# EAGLE design IoT_modules_atmega328_kinemata_v3 (EAGLE 7.2.0)
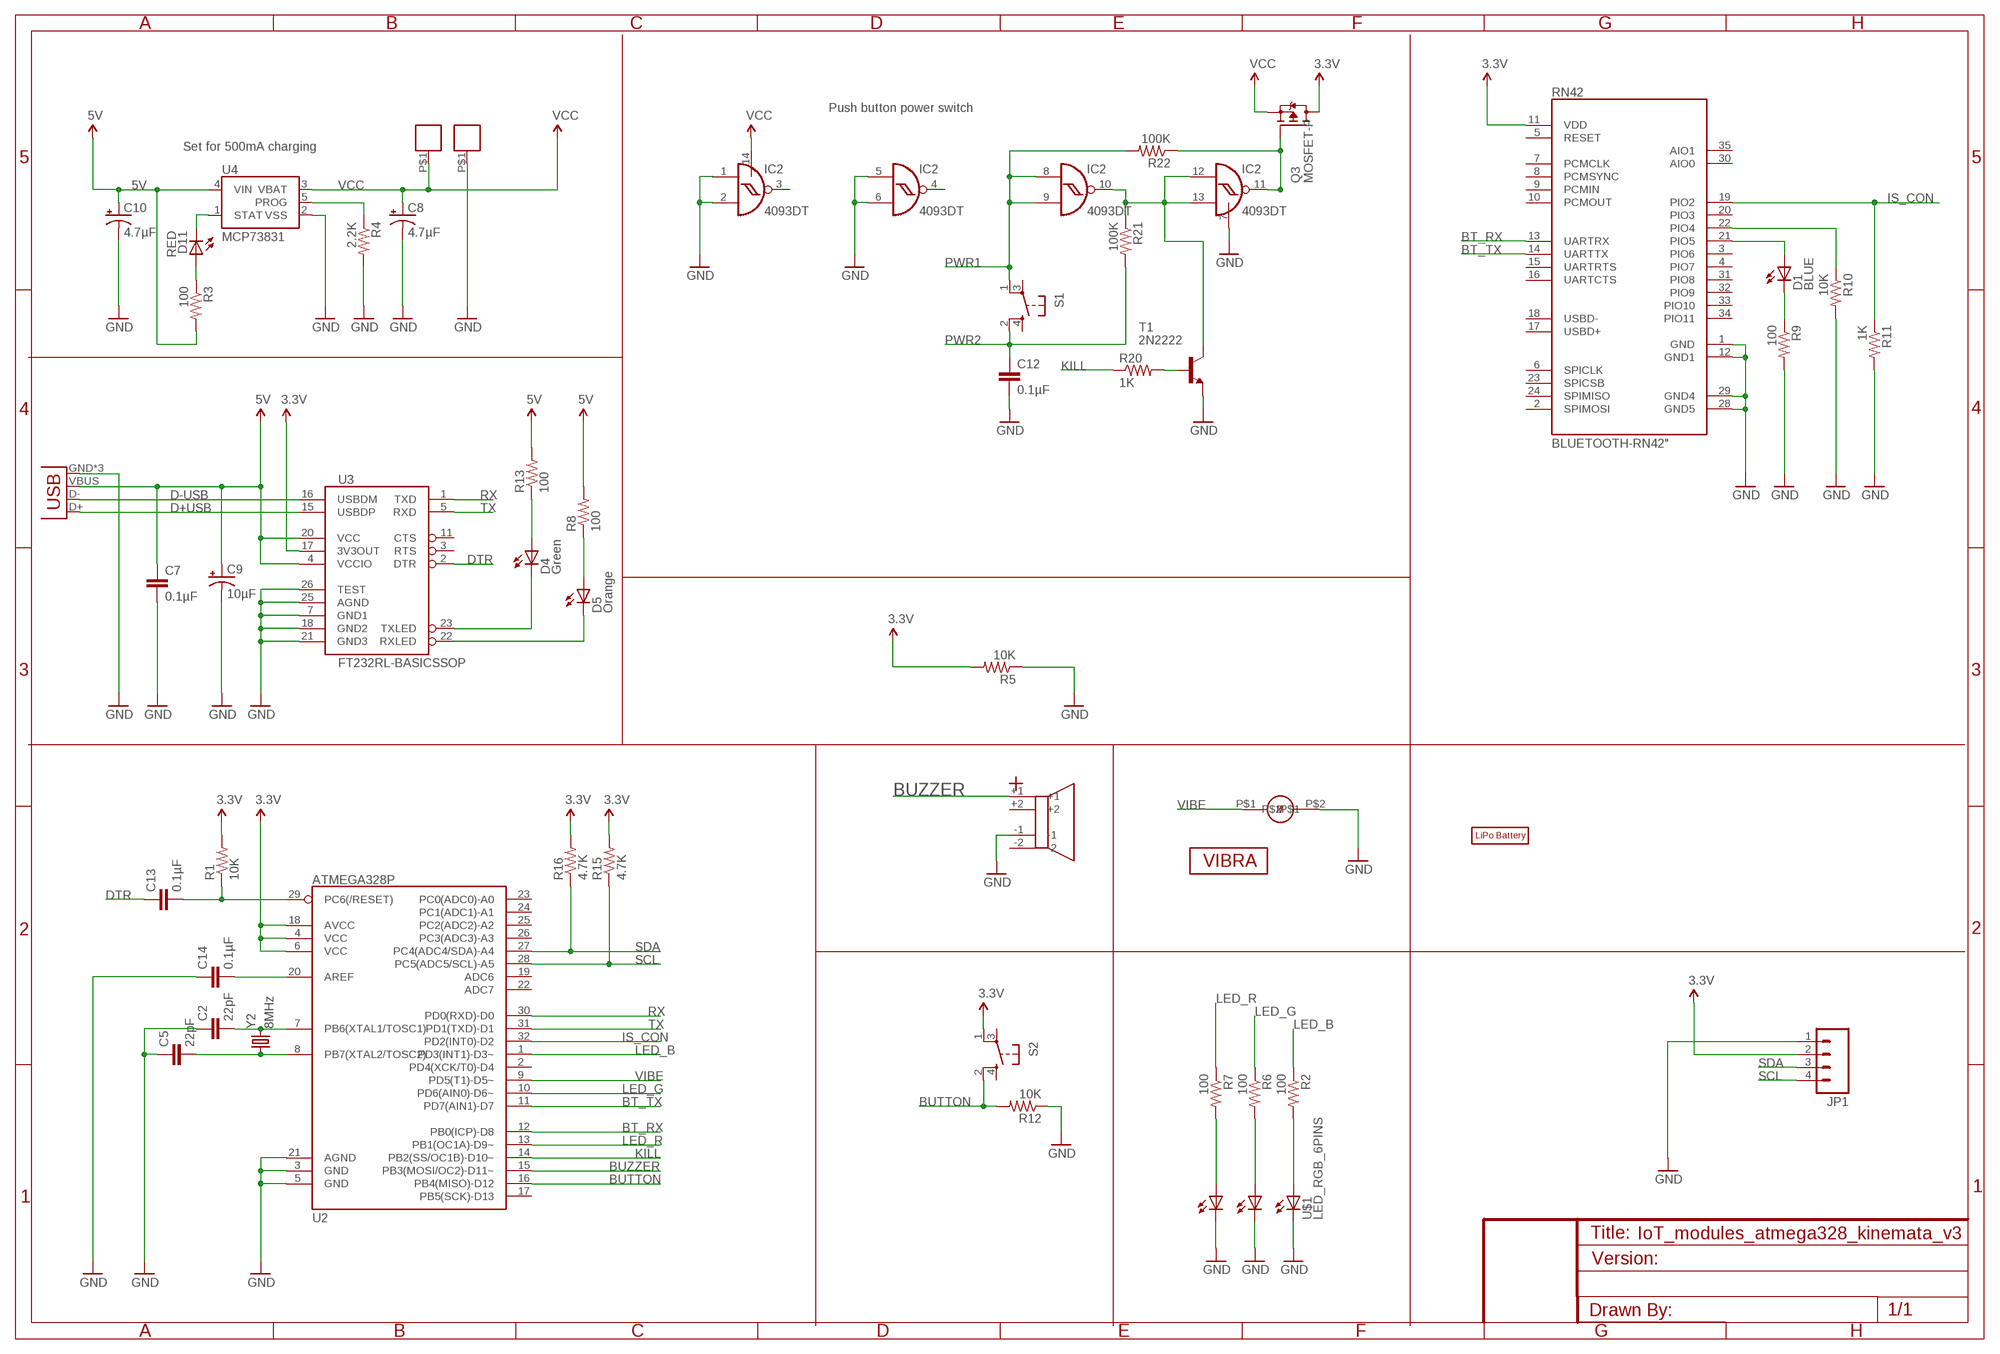
[diagram p0: schematic, sheet 1]

## Parts
BAT+2  LIPO_PAD  [LIPO_PAD]
BAT-1  LIPO_PAD  [LIPO_PAD]
C2  22pF  CAP1206  [1206]
C5  22pF  CAP1206  [1206]
C7  0.1µF  CAP1206  [1206]
C8  4.7µF  CAP_POL1206  [EIA3216]
C9  10µF  CAP_POL1206  [EIA3216]
C10  4.7µF  CAP_POL1206  [EIA3216]
C12  0.1µF  CAP1206  [1206]
C13  0.1µF  CAP1206  [1206]
C14  0.1µF  CAP1206  [1206]
D1  BLUE  LED1206  [LED-1206]
D4  Green  LED1206  [LED-1206]
D5  Orange  LED1206  [LED-1206]
D11  RED  LED1206  [LED-1206]
IC2  4093DT  [MC14093B-TSSOP14]
JP1  M04LONGPADS  [1X04_LONGPADS]
JP6  USB-MICROB  [USB-MICROB]
Q3  MOSFET-P  [SOT23]
R1  10K  RESISTOR1206  [1206]
R2  100  RESISTOR1206  [1206]
R3  100  RESISTOR1206  [1206]
R4  2.2K  RESISTOR1206  [1206]
R5  10K  RESISTOR1206  [1206]
R6  100  RESISTOR1206  [1206]
R7  100  RESISTOR1206  [1206]
R8  100  RESISTOR1206  [1206]
R9  100  RESISTOR1206  [1206]
R10  10K  RESISTOR1206  [1206]
R11  1K  RESISTOR1206  [1206]
R12  10K  RESISTOR1206  [1206]
R13  100  RESISTOR1206  [1206]
R15  4.7K  RESISTOR1206  [1206]
R16  4.7K  RESISTOR1206  [1206]
R20  1K  RESISTOR1206  [1206]
R21  100K  RESISTOR1206  [1206]
R22  100K  RESISTOR1206  [1206]
RN42  BLUETOOTH-RN42"  [RN42]
S1  TAC_SWITCH_SIDEWAY  [TACTILE_SWITCH_ANGLE_SMD]
S2  TAC_SWITCH_SIDEWAY  [TACTILE_SWITCH_ANGLE_SMD]
T1  2N2222  [TO92-EBC-OVAL]
U2  ATMEGA328P  ATMEGA328_SMT  [TQFP32-08]
U3  FT232RL-BASICSSOP  [SSOP28DB]
U4  MCP73831  [SOT23-5]
U$1  LED_RGB_6PINS  [LED_RGB_6PINS]
U$2  LIPO_BATTERY110MAH  [LIPO_BATTERY_110MAH]
U$3  BUZZER_4PINS  [FARNELL_BUZZER_MAGNETIC_SMD_3V_2215091]
U$4  VIBRATION_MOTOR_SHAPE  [VIBRATION_MOTOR_SHAPE]
U$5  VIBRATION_MOTOR  [VIBRATION_MOTOR_CABLE]
Y2  8MHz  CRYSTAL_2PINS5X3.2  [CRYSTAL_8MHZ_SMD_FARNELL_2101329]

## Nets
3.3V: JP1.2 Q3.3(D) R1.2 R5.2 R15.2 R16.2 RN42.11(VDD) S2.1(A2) U2.4(VCC) U2.6(VCC) U2.18(AVCC) U3.17(3V3OUT)
5V: C7.1 C9.A(+) C10.A(+) JP6.VBUS R3.2 R8.2 R13.2 U3.4(VCCIO) U3.20(VCC) U4.4(VIN)
BT_RX: RN42.13(UARTRX) U2.12(PB0(ICP)-D8)
BT_TX: RN42.14(UARTTX) U2.11(PD7(AIN1)-D7)
BUTTON: R12.2 S2.2(B2) U2.16(PB4(MISO)-D12)
BUZZER: U2.15(PB3(MOSI/OC2)-D11~) U$3.+1
D+USB: JP6.D+ U3.15(USBDP)
D-USB: JP6.D- U3.16(USBDM)
DTR: C13.1 U3.2(DTR)
GND: BAT-1.P$1 C2.1 C5.1 C7.2 C8.C(-) C9.C(-) C10.C(-) C12.2 C14.1 IC2.1 IC2.2 IC2.5 IC2.6 IC2.7 JP1.1 JP6.GND JP6.MT1(GND) JP6.MT2(GND) R4.2 R5.1 R9.2 R10.2 R11.2 R12.1 RN42.1(GND) RN42.12(GND1) RN42.28(GND5) RN42.29(GND4) T1.E U2.3(GND) U2.5(GND) U2.21(AGND) U3.7(GND1) U3.18(GND2) U3.21(GND3) U3.25(AGND) U3.26(TEST) U4.2(VSS) U$1.BC U$1.GC U$1.RC U$3.-1 U$5.P$2
IS_CON: R11.1 RN42.19(PIO2) U2.32(PD2(INT0)-D2)
KILL: R20.1 U2.14(PB2(SS/OC1B)-D10~)
LED_B: R2.1 U2.1(PD3(INT1)-D3~)
LED_G: R6.1 U2.10(PD6(AIN0)-D6~)
LED_R: R7.1 U2.13(PB1(OC1A)-D9~)
N$1: R7.2 U$1.BA
N$2: R2.2 U$1.GA
N$3: D11.A R3.1
N$4: R6.2 U$1.RA
N$7: D4.A R13.1
N$9: D5.A R8.1
N$12: R10.1 RN42.22(PIO4)
N$13: D1.A RN42.21(PIO5)
N$14: C5.2 U2.8(PB7(XTAL2/TOSC2)) Y2.P$1
N$16: C2.2 U2.7(PB6(XTAL1/TOSC1)) Y2.P$2
N$17: D1.C R9.1
N$18: C13.2 R1.1 U2.29(PC6(/RESET))
N$19: C14.2 U2.20(AREF)
N$23: IC2.10 IC2.12 IC2.13 R21.1 T1.C
N$24: R20.2 T1.B
N$27: IC2.11 Q3.1(G) R22.1
PROG: R4.1 U4.5(PROG)
PWR1: IC2.8 IC2.9 R22.2 S1.1(A2)
PWR2: C12.1 R21.2 S1.2(B2)
RX: U2.30(PD0(RXD)-D0) U3.1(TXD)
RXLED: D5.C U3.22(RXLED)
SCL: JP1.4 R15.1 U2.28(PC5(ADC5/SCL)-A5)
SDA: JP1.3 R16.1 U2.27(PC4(ADC4/SDA)-A4)
STAT: D11.C U4.1(STAT)
TX: U2.31(PD1(TXD)-D1) U3.5(RXD)
TXLED: D4.C U3.23(TXLED)
VCC: BAT+2.P$1 C8.A(+) IC2.14 Q3.2(S) U4.3(VBAT)
VIBE: U2.9(PD5(T1)-D5~) U$5.P$1
Unconnected: IC2.3 IC2.4 RN42.2(SPIMOSI) RN42.3(PIO6) RN42.4(PIO7) RN42.5(RESET) RN42.6(SPICLK) RN42.7(PCMCLK) RN42.8(PCMSYNC) RN42.9(PCMIN) RN42.10(PCMOUT) RN42.15(UARTRTS) RN42.16(UARTCTS) RN42.17(USBD+) RN42.18(USBD-) RN42.20(PIO3) RN42.23(SPICSB) RN42.24(SPIMISO) RN42.30(AIO0) RN42.31(PIO8) RN42.32(PIO9) RN42.33(PIO10) RN42.34(PIO11) RN42.35(AIO1) S1.3(A1) S1.4(B1) S2.3(A1) S2.4(B1) U2.2(PD4(XCK/T0)-D4) U2.17(PB5(SCK)-D13) U2.19(ADC6) U2.22(ADC7) U2.23(PC0(ADC0)-A0) U2.24(PC1(ADC1)-A1) U2.25(PC2(ADC2)-A2) U2.26(PC3(ADC3)-A3) U3.3(RTS) U3.11(CTS) U$3.+2 U$3.-2

## Notes on the sheet
- Push button power switch
- Set for 500mA charging

## Library data of the parts
BAT+2 BAT-1 = MlabPaja_v3:LIPO_PAD
C2 C5 C7 C12-C14 = SparkFun-Passives:CAP: Capacitor Standard 0603 ceramic capacitor, and 0.1" leaded capacitor.
C8-C10 = SparkFun-Passives:CAP_POL: Capacitor Polarized These are standard SMD and PTH capacitors. Normally 10uF, 47uF, and 100uF in electrolytic and tantalum varieties. Always verify the external diameter of the through hole cap, it varies with capacity, voltage, and manufacturer. The EIA devices should be standard.
D1 D4 D5 D11 = SparkFun-LED:LED: LEDs Standard schematic elements and footprints for 5mm, 3mm, 1206, and 0603 sized LEDs. 5mm - Spark Fun Electronics SKU : COM-00529 (and others)
IC2 = MlabPaja_v3:4093: Quad 2-input NAND schmitt trigger
JP1 = SparkFun-Connectors:M04: Header 4 Standard 4-pin 0.1" header. Use with straight break away headers (SKU : PRT-00116), right angle break away headers (PRT-00553), swiss pins (PRT-00743), machine pins (PRT-00117), and female headers (PRT-00115). Molex polarized connector foot print use with SKU : PRT-08231 with associated crimp pins and housings. 1MM SMD Version SKU: PRT-10208
JP6 = SparkFun-Connectors:USB: USB Connectors USB-B-PTH is fully proven SKU : PRT-00139/CONN-08278 USB-miniB is fully proven SKU : PRT-00587 USB-A-PCB is untested. USB-A-H is throughly reviewed, but untested. Spark Fun Electronics SKU : PRT-00437 USB-B-SMT is throughly reviewed, but untested. Needs silkscreen touching up. USB-A-S has not been used/tested USB-MB-H has not been used/tested USB-MICROB has been used. CONN-09505; PROD_ID: CONN-09505
Q3 = MlabPaja_v3:MOSFET-P
R1-R13 R15 R16 R20-R22 = SparkFun-Resistors:RESISTOR: Resistor Basic schematic elements and footprints for 0603, 1206, and PTH resistors.
RN42 = MlabPaja_v3:BLUETOOTH-RN42: Bluetooth SMD module
S1 S2 = MlabPaja_v3:TAC_SWITCH: Momentary Switch Button commonly used for reset or general input. Spark Fun Electronics SKU : COM-00097 SMT- SWCH-08247; PROD_ID: SWCH-08247
T1 = adafruit:2N2222: NPN TRANSISTOR Big oval pads
U2 = MlabPaja_v3:ATMEGA328_SMT: 32-Pin Atmega328 part Commonly used on Arduino compatible boards Available in QFP and QFN packages TQFP is IC-09069 QFN is non-stock; PROD_ID: IC-09069
U3 = SparkFun-DigitalIC:FT232RL-BASIC: USB UART This is the simplified version of the FT232RL unit. Only what you need, nothing you don't. Spark Fun Electronics SKU : COM-00650
U4 = SparkFun:MCP73831: Microchip's MCP73831 Miniature single cell, fully integrated Li-Ion, Li-polymer charge management controller http://ww1.microchip.com/downloads/en/DeviceDoc/21984a.pdf
U$1 = Mlab_ProEx2015:LED_RGB_6PINS
U$2 = MlabPaja_v3:LIPO_BATTERY
U$3 = MlabPaja_v2:BUZZER_4PINS
U$4 = MlabPaja_v3:VIBRATION_MOTOR_SHAPE
U$5 = MlabPaja_v3:VIBRATION_MOTOR
Y2 = MlabPaja_v2:CRYSTAL_2PINS

## Net classes
0 default: clearance 0.21 mm

## Board
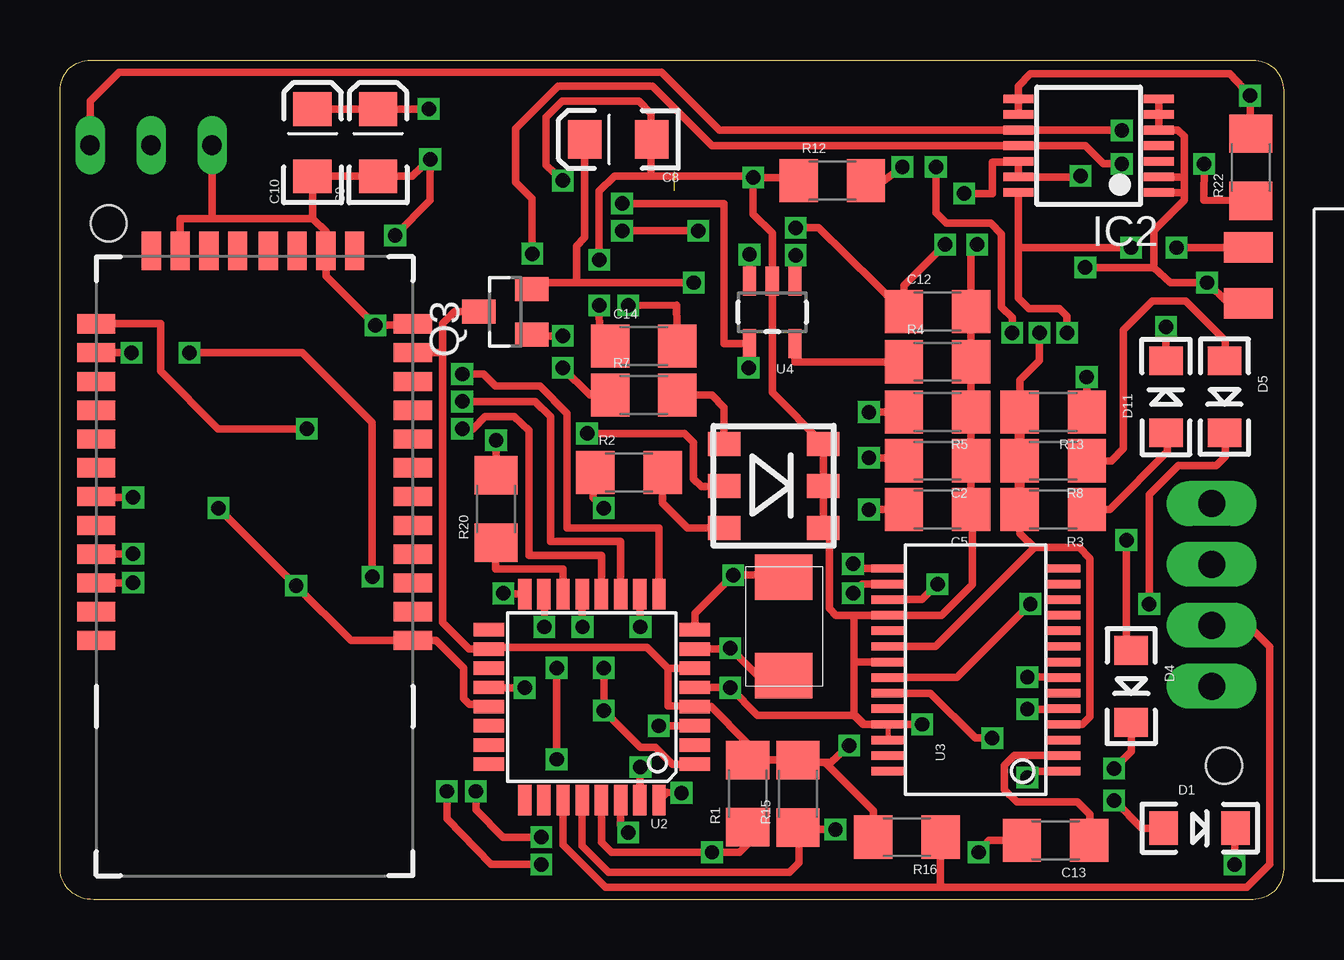
[diagram p1: board, top side]
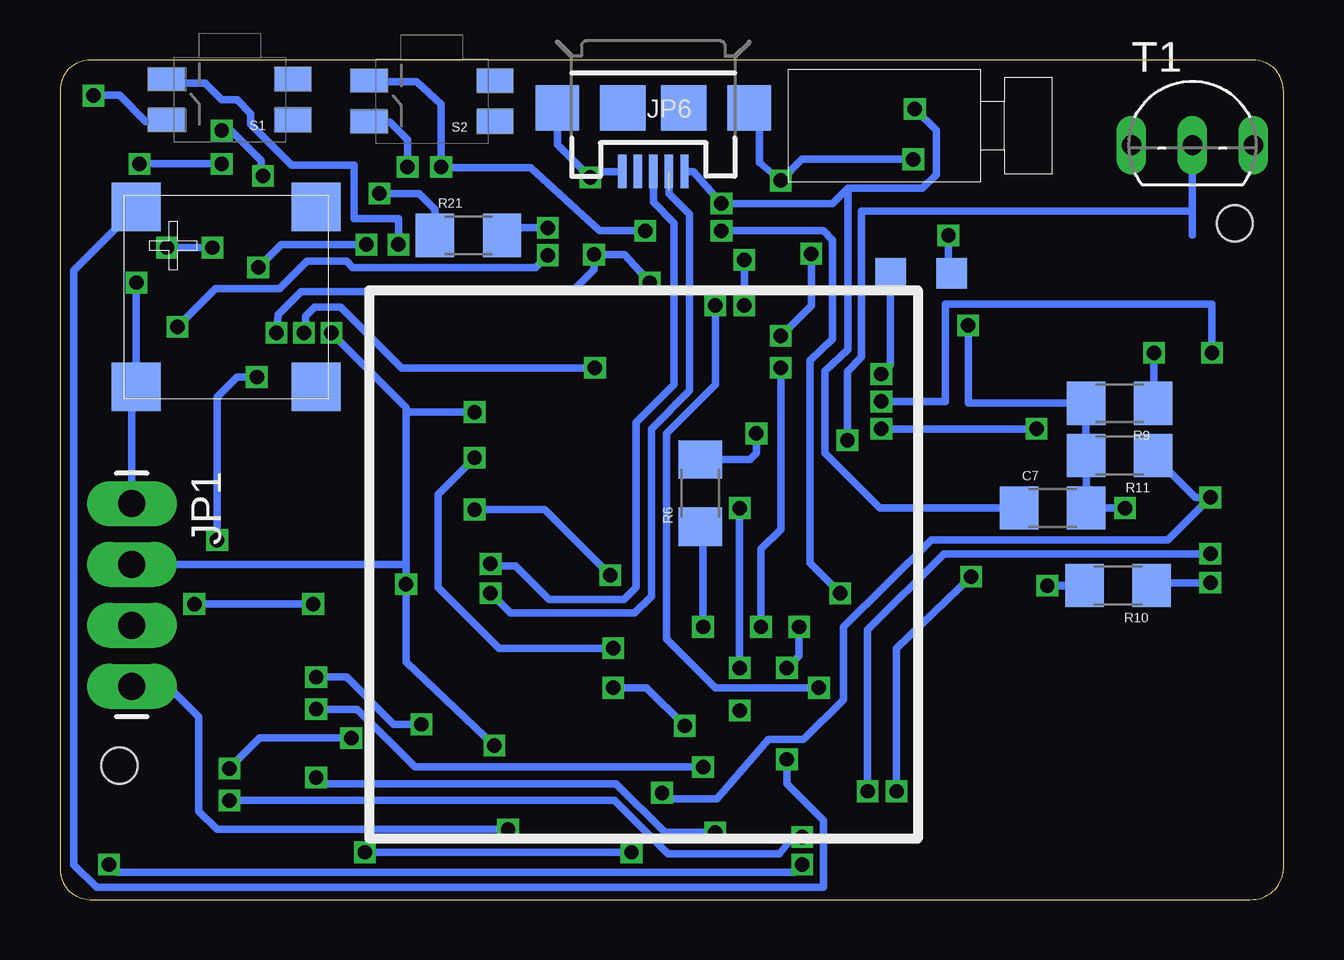
[diagram p2: board, bottom side, seen from below]

Size 51 x 35 mm. Coordinates in mm from the lower left corner, seen from the top.
Outline: 1.27,35 49.73,35 arc-90 51,33.73 51,1.27 arc-90 49.73,0 1.4,0 arc-90 0,1.26 0,33.73 arc-90 1.27,35
Copper layers (1*16): Top 0.035mm / dielectric 0.2mm / Bottom 0.035mm
Design rules "SeeedStudio_DRU_no_angle_20130527_modified": minimum track width 6mil, minimum drill 12mil, track to track 6mil, track to pad 6mil, pad to pad 6mil, via to via 6mil, smd to smd 0mil, copper to edge 10mil, drill to drill 10mil, minimum pad ring 6mil, minimum via ring 6mil, stop-mask expansion 2mil, vias tented up to drill 25mil, thermal gap 10mil
Holes 1.5 mm at 2.03,28.19 48.51,5.59

### Footprints (pad centres in the part's own frame; a part is rotated, then mirrored left to right if it is on the bottom)
LIPO_PAD = smd 2.032 x 1.27: P$1 0,0
1206 = smd 1.6 x 1.8: 1 -1.4,0; 2 1.4,0
EIA3216 = smd 1.4 x 1.6: A 1.4,0; C -1.4,0
LED-1206 = smd 1.2 x 1.4: A -1.5,0; C 1.5,0
MC14093B-TSSOP14 = smd 0.36 x 1.26: 1 -1.95,-2.925; 2 -1.3,-2.925; 3 -0.65,-2.925; 4 0,-2.925; 5 0.65,-2.925; 6 1.3,-2.925; 7 1.95,-2.925; 8 1.95,2.925; 9 1.3,2.925; 10 0.65,2.925; 11 0,2.925; 12 -0.65,2.925; 13 -1.3,2.925; 14 -1.95,2.925
1X04_LONGPADS = drill 1.118 pad 1.88 long: 1 0,0; 2 2.54,0; 3 5.08,0; 4 7.62,0
USB-MICROB = smd 0.35 x 1.4: D+ 0,2.65; D- -0.65,2.65; GND 1.3,2.65; ID 0.65,2.65; VBUS -1.3,2.65 | smd 1.8 x 1.9: MT1 -4,0; MT2 4,0 | smd 1.9 x 1.9: P$1 -1.27,0; P$2 1.27,0
SOT23 = smd 1 x 1.4: 1 -0.95,-1.1; 2 0.95,-1.1; 3 0,1.1
RN42 = smd 0.8 x 1.6: 1 -6.6,-6.6; 2 -5.4,-6.6; 3 -4.2,-6.6; 4 -3,-6.6; 5 -1.8,-6.6; 6 -0.6,-6.6; 7 0.6,-6.6; 8 1.8,-6.6; 9 3,-6.6; 10 4.2,-6.6; 11 5.4,-6.6; 12 6.6,-6.6; 13 6.6,6.6; 14 5.4,6.6; 15 4.2,6.6; 16 3,6.6; 17 1.8,6.6; 18 0.6,6.6; 19 -0.6,6.6; 20 -1.8,6.6; 21 -3,6.6; 22 -4.2,6.6; 23 -5.4,6.6; 24 -6.6,6.6 | smd 1.6 x 0.8: 28 9.65,3.1; 29 9.65,-2.973; 30 9.65,4.3; 31 9.65,1.9; 32 9.65,0.7; 33 9.65,-0.573; 34 9.65,-1.773; 35 9.65,-4.173
TACTILE_SWITCH_ANGLE_SMD = smd 1.524 x 1.016: 1 2.642,1.067; 2 2.642,-0.635; 3 -2.642,1.041; 4 -2.642,-0.635
TO92-EBC-OVAL = drill 0.813 long: B 0,-1.27; C 2.54,-1.27; E -2.54,-1.27
TQFP32-08 = smd 1.27 x 0.559: 1 -4.293,2.8; 2 -4.293,2; 3 -4.293,1.2; 4 -4.293,0.4; 5 -4.293,-0.4; 6 -4.293,-1.2; 7 -4.293,-2; 8 -4.293,-2.8; 17 4.293,-2.8; 18 4.293,-2; 19 4.293,-1.2; 20 4.293,-0.4; 21 4.293,0.4; 22 4.293,1.2; 23 4.293,2; 24 4.293,2.8 | smd 0.559 x 1.27: 9 -2.8,-4.293; 10 -2,-4.293; 11 -1.2,-4.293; 12 -0.4,-4.293; 13 0.4,-4.293; 14 1.2,-4.293; 15 2,-4.293; 16 2.8,-4.293; 25 2.8,4.293; 26 2,4.293; 27 1.2,4.293; 28 0.4,4.293; 29 -0.4,4.293; 30 -1.2,4.293; 31 -2,4.293; 32 -2.8,4.293
SSOP28DB = smd 0.348 x 1.397: 1 -4.225,-3.656; 2 -3.575,-3.656; 3 -2.925,-3.656; 4 -2.275,-3.656; 5 -1.625,-3.656; 6 -0.975,-3.656; 7 -0.325,-3.656; 8 0.325,-3.656; 9 0.975,-3.656; 10 1.625,-3.656; 11 2.275,-3.656; 12 2.925,-3.656; 13 3.575,-3.656; 14 4.225,-3.656; 15 4.225,3.656; 16 3.575,3.656; 17 2.925,3.656; 18 2.275,3.656; 19 1.625,3.656; 20 0.975,3.656; 21 0.325,3.656; 22 -0.325,3.656; 23 -0.975,3.656; 24 -1.625,3.656; 25 -2.275,3.656; 26 -2.925,3.656; 27 -3.575,3.656; 28 -4.225,3.656
SOT23-5 = smd 0.55 x 1.2: 1 -0.95,-1.3; 2 0,-1.3; 3 0.95,-1.3; 4 0.95,1.3; 5 -0.95,1.3
LED_RGB_6PINS = smd 1 x 1.35: BA -1.749,-2.07; BC -1.749,2.07; GA 1.751,-2.07; GC 1.751,2.07; RA 0.001,-2.07; RC 0.001,2.07
FARNELL_BUZZER_MAGNETIC_SMD_3V_2215091 = smd 2.032 x 2.032: +1 -3.607,3.861; +2 3.893,3.861; -1 -3.607,-3.639; -2 3.893,-3.639
VIBRATION_MOTOR_CABLE = smd 1.27 x 1.27: P$1 -1.27,0; P$2 1.27,0
CRYSTAL_8MHZ_SMD_FARNELL_2101329 = smd 1.9 x 2.4: P$1 -2.184,0.076; P$2 1.93,0.076

### Placement (x,y rotation side)
BAT+2  49.53,27.19 0 top
BAT-1  49.53,24.86 180 top
C2  36.58,18.29 180 top
C5  36.58,16.26 180 top
C7  9.63,16.32 0 bottom
C8  23.27,31.69 180 top
C9  13.26,31.55 90 top
C10  10.53,31.55 90 top
C12  36.58,24.51 0 top
C13  41.5,2.47 180 top
C14  24.34,23.07 0 top
D1  47.5,2.97 0 top
D4  44.65,8.89 270 top
D5  48.54,20.95 270 top
D11  46.1,20.95 90 top
IC2  42.88,31.43 90 top
JP1  48.01,16.51 270 bottom
JP6  26.27,33 180 bottom
Q3  18.56,24.5 90 top
R1  28.66,4.42 90 top
R2  23.72,17.8 0 top
R3  41.4,16.26 180 top
R4  36.58,22.42 0 top
R5  36.58,20.32 180 top
R6  24.31,16.94 90 bottom
R7  24.33,21.03 0 top
R8  41.4,18.29 180 top
R9  6.83,20.69 180 bottom
R10  6.9,13.09 180 bottom
R11  6.83,18.52 180 bottom
R12  32.19,29.97 0 top
R13  41.4,20.32 180 top
R15  30.77,4.4 90 top
R16  35.3,2.6 180 top
R20  18.18,16.28 90 top
R21  33.97,27.69 0 bottom
R22  49.63,30.53 90 top
RN42  8.11,17.4 90 top
S1  43.92,33.56 180 bottom
S2  35.49,33.5 180 bottom
T1  3.8,32.72 0 bottom
U2  22.17,8.44 180 top
U3  38.17,9.58 90 top
U4  29.69,24.48 180 top
U$1  29.75,17.25 270 top
U$2  57.93,16.02 90 top  (outside the outline)
U$3  44.21,25.02 0 bottom
U$4  15.94,32.38 180 bottom
U$5  15.11,26.1 0 bottom
Y2  30.1,11.26 270 top

### Tracks (layer width: path | path; a pad name or v marks a point on that pad's centre or on a via)
3.3V  (via drill 0.6)
  Top 0.203: R15.2 30.77,5.82 | 28.66,5.84 R1.2
  Top 0.305: 31.88,5.71 33.9,3.69 R16.2 | 17.4,24.44 arc-90 Q3.3 16.45,24.51 15.94,24 15.94,22.8 | 15.94,22.8 15.94,11.56 17.05,10.44 U2.18 17.94,10.51 24.47,10.51 25.34,9.64 | 26.42,8 arc90 U2.4 | R5.2 v33.72,20.32 | RN42.11 15.94,22.8 | U2.6 25.34,9.64 | 25.34,9.64 25.34,8.06 26.46,8.06 U2.4 | U2.4 27.14,8.04 28.64,6.54 28.64,5.84 R1.2 30.75,5.82 R15.2 30.86,5.71 31.88,5.71 | 31.88,5.71 32.13,5.71 v32.89,6.41 | v36.58,13.14 35.93,12.5 U3.17 | v39.69,23.62 39.69,24.26 39.24,24.7 39.24,27.75 38.8,28.19 36.96,28.19 36.51,28.64 v36.51,30.54
  Bottom 0.305: S2.1 37.34,32.41 37.23,32.41 36.51,31.69 v36.51,30.54 | v32.89,6.41 36.58,9.91 v36.58,13.14 36.58,13.97 | JP1.2 36.58,13.97 | v33.72,20.32 36.58,20.32 | 36.58,20.32 36.58,13.97 | v39.69,23.62 36.58,20.51 36.58,20.32
5V  (via drill 0.6)
  Top 0.305: U3.20 36.49,10.55 40.6,14.67 | U3.4 42.61,7.3 42.93,7.62 42.93,14.22 42.48,14.67 40.6,14.67 | C10.A C9.A 14.91,32.95 v15.37,32.96 | v23.43,29.02 27.69,29.02 27.69,23.18 U4.4 28.74,22.2 v28.7,22.16 | R13.2 40,21.65 40.83,22.48 v40.83,23.62 | R3.2 40.01,15.27 40.6,14.67
  Top 0.406: R3.2 R8.2 R13.2
  Bottom 0.305: 18.16,29.65 18.16,22.92 19.11,22.04 19.11,18.61 16.83,16.32 C7.1 | 18.16,29.65 15.05,29.65 14.48,30.23 14.48,32.07 v15.37,32.96 | JP6.VBUS 24.59,30.35 v23.43,29.02 18.8,29.02 18.16,29.65 | v28.7,22.16 36.77,22.16 39.31,24.7 40.39,24.7 40.77,24.32 40.77,23.69 v40.83,23.62
BT_RX  (via drill 0.6)
  Top 0.305: U2.12 22.57,14.35 19.56,14.35 19.56,19.56 18.92,20.13 17.72,20.13 17.21,19.62 v16.76,19.62 | RN42.13 4.19,24 4.19,22.04 6.6,19.62 v10.29,19.62
  Bottom 0.305: v16.76,19.62 v10.29,19.62
BT_TX  (via drill 0.6)
  Top 0.305: U2.11 23.37,14.92 20.45,14.92 20.45,20.13 19.81,20.77 v16.76,20.77 | v2.98,22.8 RN42.14
  Bottom 0.305: v16.76,20.77 14.1,20.77 14.1,24.83 2.98,24.83 v2.98,22.8
BUTTON  (via drill 0.6)
  Top 0.305: U2.16 18.51,12.73 v18.48,12.76 | v23.43,27.88 v26.61,27.88 | R12.2 34.35,29.97 v35.12,30.54
  Bottom 0.305: v18.48,12.76 19.75,14.03 19.75,22.48 18.8,23.37 18.8,27.5 19.18,27.88 v23.43,27.88 | S2.2 37.27,34.1 36.13,34.1 35.12,33.15 v35.12,30.54 35.08,30.5 31.39,30.5 28.51,27.88 v26.61,27.88
BUZZER  (via drill 0.6)
  Top 0.305: v20.19,11.37 20.19,12.71 U2.15 | v20.7,5.84 v20.7,9.65
  Bottom 0.203: U$3.+1 47.95,28.7
  Bottom 0.305: v20.19,11.37 20.19,10.16 v20.7,9.65 | v20.7,5.84 20.7,4.83 19.18,3.3 19.18,0.51 19.18,0.5 49.47,0.5 50.42,1.45 50.42,26.23 47.95,28.7
D+USB  (via drill 0.6)
  Top 0.305: v33.06,13.99 33.25,13.8 U3.15
  Bottom 0.305: v33.06,13.99 32.97,13.91 32,13.91 30.61,12.51 27.5,12.51 26.99,13.02 26.99,19.88 25.4,21.46 25.4,28.19 26.27,29.06 JP6.D+
D-USB  (via drill 0.6)  (1 unrouted)
  Top 0.305: v33.06,12.77 33.44,13.15 U3.16
  Bottom 0.305: v33.06,12.77 32.22,11.94 27.05,11.94 26.35,12.64 26.35,19.62 24.77,21.21 24.77,28.57 25.62,29.43 25.62,29.56
DTR
  Top 0.305: C13.1 42.92,3.54 42.4,4.06 39.88,4.06 39.37,4.57 39.37,5.59 39.78,6 U3.2
GND  (via drill 0.6)
  Top 0.203: U3.25 U3.26 | C9.C 13.26,30.48
  Top 0.305: C5.1 37.85,16.26 | IC2.2 46.83,30.12 46.86,30.16 | IC2.7 IC2.6 IC2.5 46.6,32.08 46.86,31.81 46.86,30.16 | C14.1 22.49,23.57 v22.48,24.77 | U2.5 27.48,8.84 v27.94,8.83 29.08,7.68 33.08,7.68 33.46,7.3 U3.25 | v24.96,7.24 U2.3 | U3.25 33.53,7.3 33.08,7.75 33.08,9.9 | RN42.28 5.01,28.38 6.34,28.38 | 10.54,28.38 10.54,30.13 C10.C C9.C 14.68,30.15 v15.43,30.86 15.43,29.15 v13.97,27.69 | 24.64,30.16 24.64,31.85 C8.C 24.64,31.72 24.64,32.77 24.13,33.27 20.92,33.27 20.26,32.61 20.26,30.61 v20.95,29.97 | 24.64,30.16 23.11,30.16 22.48,29.53 v22.48,26.67 | RN42.12 14.71,23.94 v13.14,23.94 11.09,26 RN42.29 11.09,27.84 10.54,28.38 | U2.21 17.79,8.13 17.08,8.13 16.83,8.38 16.83,9.65 15.68,10.8 RN42.1 12.13,10.79 v9.84,13.08 v6.6,16.32 | 6.34,28.38 10.54,28.38 | 33.08,11.85 U3.18 36.74,11.85 38.04,13.14 38.04,16.2 C5.1 | 33.08,11.85 32.34,11.85 32.07,12.13 32.07,15.12 U$1.GC U$1.RC U$1.BC 29.69,21.13 U4.2 29.69,27.78 28.89,28.57 v28.89,30.1 | U3.21 33.08,9.9 | 33.08,9.9 33.08,11.85 | C5.1 C2.1 R5.1 R4.2 C12.2 37.98,27.05 v38.23,27.3 | 24.64,30.16 28.83,30.16 v28.89,30.1 | 46.86,30.16 46.86,29.46 | 46.86,29.46 46.86,29.15 45.59,27.88 45.59,26.35 | 45.59,26.35 v42.74,26.35 | 45.59,26.35 46.29,25.72 v47.82,25.72 48.67,24.89 BAT-1.P$1 | IC2.1 46.85,29.48 46.86,29.46 | U3.7 41.81,9.27 v40.32,9.27 | v35.94,7.3 U3.25 | U3.25 | T1.E 6.34,28.38 | v28.89,30.1 30.67,30.1 R12.1
  Bottom 0.203: R11.2 8.23,18.67
  Bottom 0.305: JP1.1 48.01,20.93 arc45 U$3.-1 v47.82,25.72 | R11.2 arc90 R11.2 C7.2 v6.6,16.32 | 8.23,18.67 R9.2 13.14,20.69 v13.14,23.94 | v38.23,27.3 41.78,27.3 v42.74,26.35 | v22.48,24.77 v22.48,26.67 | v27.94,8.83 26.54,8.83 v24.96,7.24 | v40.32,9.27 39.05,9.27 37.08,7.3 v35.94,7.3 | JP6.MT1 21.84,33.43 21.84,30.73 v20.95,29.97 20.07,30.86 v15.43,30.86 | JP6.GND 28.64,30.35 v28.89,30.1 30.27,31.48 JP6.MT2 | U$5.P$2 13.97,26.24 v13.97,27.69 | v9.84,13.08 R10.2 9.83,13.09 v9.84,13.08
  cutout Bottom: -1.27,36.83 51.8,36.83 51.8,-1.27 15.24,-1.27 15.24,10.16 -1.27,10.16
  cutout Top: -1.27,36.83 -1.27,10.16 15.24,10.16 15.24,-1.27 51.8,-1.27 51.8,36.83
IS_CON  (via drill 0.6)
  Top 0.305: RN42.19 arc90 1.55,16.76 v3.05,16.76 | U2.32 25.3,4.47 v25.91,4.45
  Bottom 0.203: 5.46,18.52 R11.1
  Bottom 0.305: v25.91,4.45 25.65,4.19 23.62,4.19 21.46,6.67 20,6.67 18.35,8.32 18.35,11.37 14.67,14.99 4.83,14.99 v3.05,16.76 3.68,16.76 R11.1
KILL
  Top 0.305: U2.14 20.97,13.78 18.16,13.78 18.16,14.44 R20.1
LED_B  (via drill 0.6)
  Top 0.305: v22.67,9.65 v22.67,7.87 24.19,6.35 24.83,6.35 25.54,5.64 U2.1 | R2.1 22.23,17.71 22.23,16.76 v22.67,16.32
  Bottom 0.305: v22.67,9.65 v22.67,16.32
LED_G  (via drill 0.6)
  Top 0.305: U2.10 24.17,11.52 v24.19,11.37
  Bottom 0.305: v24.19,11.37 24.19,15.53 R6.1
LED_R  (via drill 0.6)
  Top 0.305: U2.13 21.77,11.49 v21.78,11.37 | R7.1 22.09,21.03 v20.95,22.16
  Bottom 0.305: v21.78,11.37 21.78,14.61 20.95,15.43 v20.95,22.16
N$1
  Top 0.305: R7.2 27.17,21.03 27.69,20.51 U$1.BA
N$2
  Top 0.305: R2.2 25.12,16.54 26.16,15.49 U$1.GA
N$3
  Top 0.305: 45.97,19.41 D11.A 46.16,19.39 46.16,18.67 43.75,16.26 R3.1
N$4  (via drill 0.6)
  Top 0.305: v21.97,19.43 26.04,19.43 26.42,19.05 26.42,17.53 26.73,17.21 27.64,17.21 U$1.RA
  Bottom 0.305: R6.2 22.23,18.34 21.97,18.61 v21.97,19.43
N$7  (via drill 0.6)
  Top 0.305: R13.1 v42.8,21.78 | v44.45,14.99 44.45,10.59 D4.A
  Bottom 0.305: v42.8,21.78 43.62,21.78 44.45,20.95 v44.45,14.99
N$9
  Top 0.305: R8.1 43.81,18.29 44.32,18.8 44.32,23.75 45.53,24.96 46.93,24.96 48.58,23.3 48.58,22.49 D5.A
N$12  (via drill 0.6)
  Top 0.305: RN42.22 3.04,13.2 v3.05,13.21
  Bottom 0.305: v3.05,13.21 5.38,13.21 R10.1
N$13  (via drill 0.6)
  Top 0.305: D1.A 45.1,2.97 v43.94,4.13 | v20.07,2.6 18.48,2.6 17.34,3.75 v17.34,4.51 | v3.05,14.41 1.53,14.41 RN42.21
  Bottom 0.305: v43.94,4.13 27.88,4.13 25.65,1.91 21.02,1.91 20.45,2.6 v20.07,2.6 | v17.34,4.51 17.34,11.24 14.16,14.41 v3.05,14.41
N$14  (via drill 0.6)
  Top 0.305: Y2.P$1 30.09,13.53 v28.07,13.53 26.46,11.92 U2.8 | C5.2 v33.72,16.26
  Bottom 0.305: v33.72,16.26 30.8,16.26 v28.07,13.53
N$16  (via drill 0.6)
  Top 0.305: U2.7 27.9,10.44 v27.94,10.48 29.09,9.32 Y2.P$2 | v33.72,18.41 35.11,18.41 C2.2
  Bottom 0.305: v27.94,10.48 32.7,10.48 35.24,13.02 35.24,16.89 v33.72,18.41
N$17  (via drill 0.6)
  Top 0.305: v20.07,1.46 17.97,1.46 16.13,3.37 v16.13,4.51 | v13.02,13.46 13.02,19.88 10.1,22.8 v5.4,22.8 | v48.96,1.46 48.96,2.93 D1.C
  Bottom 0.305: v5.4,22.8 5.4,20.73 R9.1 | v13.02,13.46 16.13,10.48 v16.13,4.51 | v20.07,1.46 20.38,1.14 48.64,1.14 v48.96,1.46
N$18  (via drill 0.6)
  Top 0.305: 28.57,2.92 R1.1 28.7,2.98 28.7,2.35 28.32,1.97 v27.18,1.97 22.99,1.97 22.57,2.39 U2.29 | C13.2 38.73,2.47 v38.29,1.97
  Bottom 0.305: v38.29,1.97 v27.18,1.97
N$19  (via drill 0.6)
  Top 0.305: C14.2 25.7,24.78 v23.69,24.77 | v19.37,8.83 17.89,8.83 U2.20
  Bottom 0.305: v23.69,24.77 23.69,21.46 25.72,19.43 25.72,10.86 23.69,8.83 v19.37,8.83
N$23  (via drill 0.6)
  Top 0.305: IC2.12 IC2.13 42.51,30.12 v42.55,30.16 | IC2.12 39.93,30.67 | IC2.12 39.91,30.73 38.86,30.73 38.86,29.43 v37.69,29.43 | v44.26,32.07 43.81,32.08 IC2.10 27.49,32.08 25.08,34.48 2.48,34.48 1.27,33.27 T1.C
  Bottom 0.305: R21.1 35.37,28.77 36.04,29.43 v37.69,29.43 | v44.26,32.07 43.88,32.07 42.61,30.8 42.61,30.16 v42.55,30.16
N$24  (via drill 0.6)
  Top 0.305: v18.18,19.14 R20.2
  Bottom 0.305: v18.18,19.14 18.18,22.02 17.59,22.61 17.59,28.7 3.81,28.7 3.8,27.7 T1.B
N$27  (via drill 0.6)
  Top 0.305: v20.95,23.5 19.72,23.5 Q3.1 | v47.69,30.67 47.68,29.15 R22.1 | v19.68,26.92 19.68,29.21 18.99,29.91 18.99,32.13 20.77,33.91 24.7,33.91 27.19,31.43 IC2.11 42.74,31.43 43.5,30.67 v44.26,30.67
  Bottom 0.305: v19.68,26.92 19.68,24.77 v20.95,23.5 | v44.26,30.67 v47.69,30.67
PROG
  Top 0.305: U4.5 30.64,22.42 R4.1
PWR1  (via drill 0.6)
  Top 0.305: IC2.9 IC2.8 39.94,33.91 40.45,34.42 48.77,34.42 v49.61,33.51 R22.2
  Bottom 0.305: S1.1 46.66,32.43 47.42,32.43 48.51,33.53 49.59,33.53 v49.61,33.51
PWR2  (via drill 0.6)
  Top 0.305: v30.67,28 31.62,28 C12.1 35.18,25.59 v36.89,27.3
  Bottom 0.305: R21.2 32.26,28 v30.67,28 | v36.89,27.3 36.89,28.38 38.73,28.38 38.73,30.61 41.34,30.61 43.05,32.32 43.05,32.77 43.62,33.34 44.26,33.34 44.96,34.04 46.14,34.04 S1.2
RX  (via drill 0.6)
  Top 0.305: U2.30 23.37,3.11 v23.69,2.79 | U3.1 40.34,5.35 v40.32,5.08
  Bottom 0.305: v23.69,2.79 25.78,2.79 27.81,4.83 39.81,4.83 v40.32,5.08
RXLED  (via drill 0.6)
  Top 0.305: U3.22 37.38,9.25 v40.45,12.32 | v45.4,12.32 45.4,16.89 46.61,18.1 48.2,18.1 48.58,18.48 48.58,19.42 D5.C
  Bottom 0.305: v40.45,12.32 v45.4,12.32
SCL  (via drill 0.6)
  Top 0.305: R15.1 30.85,2.92 v32.32,2.92 | 30.73,2.97 R15.1 | U2.28 21.77,2.23 22.86,1.14 30.42,1.14 30.8,1.52 30.8,2.97 R15.1
  Bottom 0.305: v32.32,2.92 44.45,2.92 45.21,3.68 45.21,7.62 46.48,8.89 JP1.4
SDA
  Top 0.305: JP1.3 49.53,11.43 50.42,10.54 50.42,1.46 49.47,0.51 36.7,0.51 | 36.45,2.03 R16.1 36.7,2.03 36.7,0.51 | 20.95,4.13 U2.27 20.97,2.27 22.73,0.51 36.7,0.51
STAT  (via drill 0.6)
  Top 0.305: 30.61,25.81 arc90 U4.1 30.67,25.82 v30.67,26.86 | D11.C v46.1,23.88
  Bottom 0.305: v46.1,23.88 44.51,25.46 41.85,25.46 40.7,26.61 39.05,26.61 38.8,26.35 31.18,26.35 v30.67,26.86
TX  (via drill 0.6)
  Top 0.305: 24.17,5.37 v24.19,5.52 24.17,5.5 U2.31 | v40.32,7.94 41.81,7.94 U3.5
  Bottom 0.305: v40.32,7.94 38.61,7.94 36.2,5.52 v24.19,5.52
TXLED  (via drill 0.6)
  Top 0.305: U3.23 36.29,8.6 38.16,6.73 v38.86,6.73 | v43.94,5.46 44.65,6.17 D4.C
  Bottom 0.305: v38.86,6.73 42.67,6.73 v43.94,5.46
VCC  (via drill 0.6)
  Top 0.305: v26.42,25.72 21.59,25.72 | 21.59,25.72 19.93,25.72 Q3.2 | IC2.14 39.95,27.18 | 39.95,27.18 39.95,25.07 40.39,24.64 41.66,24.64 41.97,24.32 v41.97,23.62 | U4.3 v28.74,26.89 | v44.64,27.18 39.95,27.18 | v46.55,27.18 49.31,27.18 BAT+2.P$1 | C8.A 21.87,27.59 21.53,27.24 21.53,25.78 21.59,25.72
  Bottom 0.305: v41.97,23.62 41.91,24.38 40.96,25.34 29.65,25.34 28.74,26.25 v28.74,26.89 27.46,26.89 v26.42,25.72 | v44.64,27.18 v46.55,27.18
VIBE  (via drill 0.6)
  Top 0.305: U2.9 24.97,15.49 21.14,15.49 21.14,20.26 20,21.4 18.16,21.4 17.65,21.91 v16.76,21.91
  Bottom 0.305: v16.76,21.91 16.38,22.3 U$5.P$1